# Altium project equalizer_project.PrjPcb
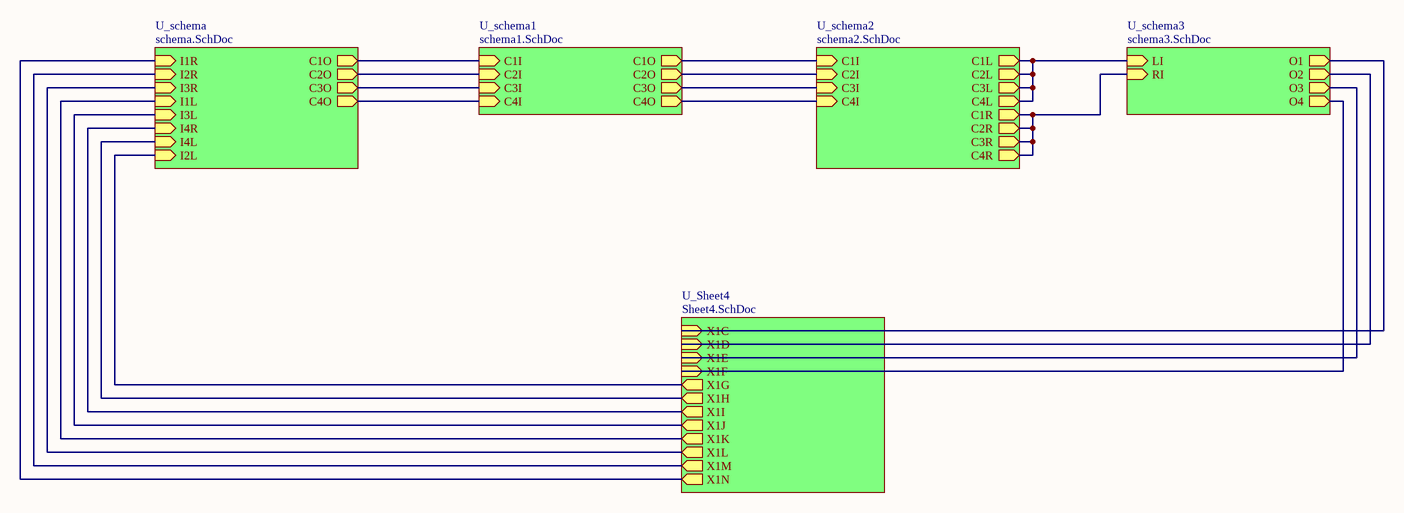
[diagram p0: top_sheet.SchDoc]
4 sheets, 127 parts. Net scope: hierarchical (ports join the sheet entries above them; power ports are global).
Board file: eq.PcbDoc
Sheets:
  top_sheet.SchDoc
    U_Sheet4 = Sheet4.SchDoc
    U_schema = schema.SchDoc
    U_schema3 = schema3.SchDoc

## Sheet top_sheet.SchDoc
size A4

### Sub-sheets
U_schema = schema.SchDoc: C1O (out), C2O (out), C3O (out), C4O (out), I1R (in), I2R (in), I3R (in), I1L (in), I3L (in), I4R (in), I4L (in), I2L (in)
U_schema1 = schema1.SchDoc (file not in this document): C1I (in), C2I (in), C3I (in), C4I (in), C1O (out), C2O (out), C4O (out), C3O (out)
U_schema2 = schema2.SchDoc (file not in this document): C1I (in), C2I (in), C3I (in), C4I (in), C1L (out), C1R (out), C2L (out), C2R (out), C3L (out), C3R (out), C4L (out), C4R (out)
U_schema3 = schema3.SchDoc: LI (in), RI (in), O1 (out), O2 (out), O3 (out), O4 (out)
U_Sheet4 = Sheet4.SchDoc: X1C (in), X1D (in), X1E (in), X1F (in), X1G (out), X1H (out), X1I (out), X1J (out), X1K (out), X1L (out), X1M (out), X1N (out)

### Nets
Net2514-_3: sheet U_Sheet4/X1C, sheet U_schema3/O1
Net2514-_4: sheet U_Sheet4/X1D, sheet U_schema3/O2
Net2514-_5: sheet U_Sheet4/X1E, sheet U_schema3/O3
Net2514-_6: sheet U_Sheet4/X1F, sheet U_schema3/O4
Net2514-_7: sheet U_Sheet4/X1G, sheet U_schema/I2L
Net2514-_8: sheet U_Sheet4/X1H, sheet U_schema/I4L
Net2514-_9: sheet U_Sheet4/X1I, sheet U_schema/I4R
Net2514-_10: sheet U_Sheet4/X1J, sheet U_schema/I3L
Net2514-_11: sheet U_Sheet4/X1K, sheet U_schema/I1L
Net2514-_12: sheet U_Sheet4/X1L, sheet U_schema/I3R
Net2514-_13: sheet U_Sheet4/X1M, sheet U_schema/I2R
Net2514-_14: sheet U_Sheet4/X1N, sheet U_schema/I1R
NetR53_2: sheet U_schema/C1O, sheet U_schema1/C1I
NetR54_2: sheet U_schema/C2O, sheet U_schema1/C2I
NetR55_2: sheet U_schema/C3O, sheet U_schema1/C3I
NetR56_2: sheet U_schema/C4O, sheet U_schema1/C4I
NetVR139_A3: sheet U_schema2/C1L, sheet U_schema2/C2L, sheet U_schema2/C3L, sheet U_schema2/C4L, sheet U_schema3/LI
NetVR139_B3: sheet U_schema2/C1R, sheet U_schema2/C2R, sheet U_schema2/C3R, sheet U_schema2/C4R, sheet U_schema3/RI
(unnamed): sheet U_schema1/C1O, sheet U_schema2/C1I
(unnamed): sheet U_schema1/C2O, sheet U_schema2/C2I
(unnamed): sheet U_schema1/C4O, sheet U_schema2/C4I
(unnamed): sheet U_schema1/C3O, sheet U_schema2/C3I

## Sheet Sheet4.SchDoc
size A4
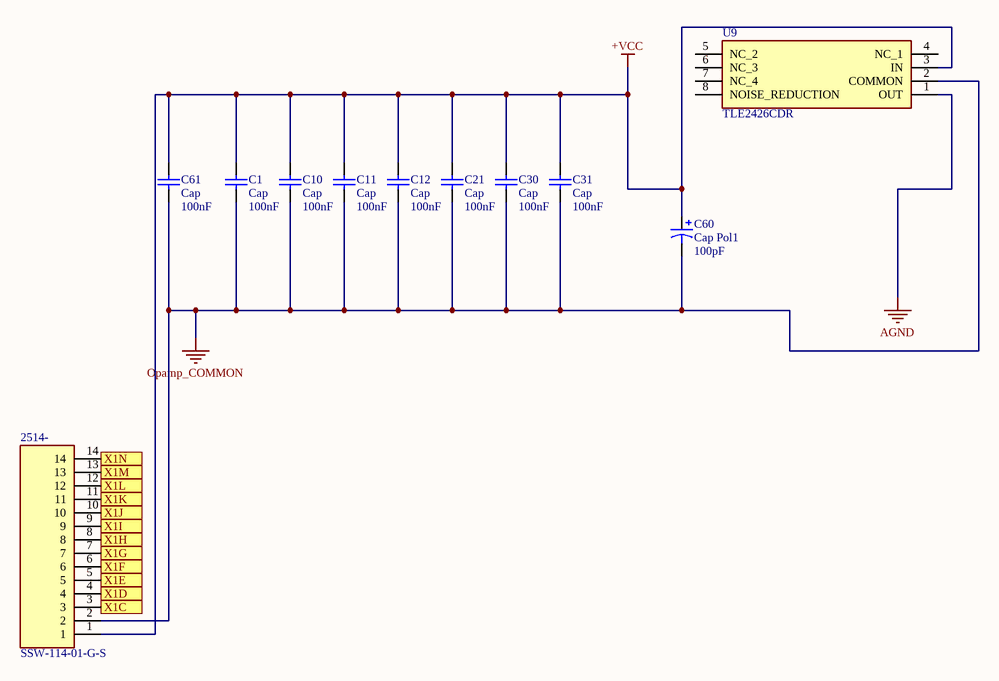
[diagram p1: Sheet4.SchDoc]

### Parts
2514-  SSW-114-01-G-S  [SHDR14W79P0X254_1X14_3607X241X851P]
C1  Cap  value 100nF  [SMD_CAPACITOR]
C10  Cap  value 100nF  [SMD_CAPACITOR]
C11  Cap  value 100nF  [SMD_CAPACITOR]
C12  Cap  value 100nF  [SMD_CAPACITOR]
C21  Cap  value 100nF  [SMD_CAPACITOR]
C30  Cap  value 100nF  [SMD_CAPACITOR]
C31  Cap  value 100nF  [SMD_CAPACITOR]
C60  Cap Pol1  value 100pF  [SMD_POLAR_CAPACITOR]
C61  Cap  value 100nF  [SMD_CAPACITOR]
U9  TLE2426CDR  [SOIC127P600X175-8N]

### Ports
X1C (in), X1D (in), X1E (in), X1F (in), X1G (out), X1H (out), X1I (out), X1J (out), X1K (out), X1L (out), X1M (out), X1N (out)

### Nets
+VCC: 2514-.1 C1.2 C10.2 C11.2 C12.2 C21.2 C30.2 C31.2 C60.1 C61.2 U9.3(IN)
AGND: U9.1(OUT)
Opamp_COMMON: 2514-.2 C1.1 C10.1 C11.1 C12.1 C21.1 C30.1 C31.1 C60.2 C61.1 U9.2(COMMON)  [project net opamp7gnd]
Net2514-_3: 2514-.3 ; port X1C
Net2514-_4: 2514-.4 ; port X1D
Net2514-_5: 2514-.5 ; port X1E
Net2514-_6: 2514-.6 ; port X1F
Net2514-_7: 2514-.7 ; port X1G
Net2514-_8: 2514-.8 ; port X1H
Net2514-_9: 2514-.9 ; port X1I
Net2514-_10: 2514-.10 ; port X1J
Net2514-_11: 2514-.11 ; port X1K
Net2514-_12: 2514-.12 ; port X1L
Net2514-_13: 2514-.13 ; port X1M
Net2514-_14: 2514-.14 ; port X1N

Not connected (* = marked no-connect by the designer): U9 4(NC_1) 5(NC_2) 6(NC_3) 7(NC_4) 8(NOISE_REDUCTION)

### Library data of the parts
2514- = SSW-114-01-G-S: Capacitor; Manufacturer_Name: SAMTEC; Datasheet Link: http://suddendocs.samtec.com/prints/ssw-1xx-xx-xxx-x-xx-xxx-xx-mkt.pdf; Height: 8.51mm; Manufacturer_Part_Number: SSW-114-01-G-S
C1 C10-C12 C21 C30 C31 C61 = Cap: Capacitor; Published: 8-Jun-2000; LatestRevisionDate: 17-Jul-2002; LatestRevisionNote: Re-released for DXP Platform.; PackageReference: RAD-0.3; Publisher: Altium Limited; PackageDescription: Radial Cap, Thru-Hole; 2 Leads; 0.3 in Pin Spacing
C60 = Cap Pol1: Polarized Capacitor (Radial); Published: 8-Jun-2000; LatestRevisionDate: 17-Jul-2002; LatestRevisionNote: Re-released for DXP Platform.; PackageReference: RB7.6-15; Publisher: Altium Limited; PackageDescription: Polarized Capacitor (Radial); 2 Leads
U9 = TLE2426CDR: Integrated Circuit; Manufacturer_Name: Texas Instruments; Datasheet Link: http://www.ti.com/lit/gpn/TLE2426; Height: 1.75mm; Mouser2 Part Number: 595-TLE2426CDR; Mouser2 Price/Stock: https://www.mouser.com/Search/Refine.aspx?Keyword=595-TLE2426CDR; Manufacturer_Part_Number: TLE2426CDR

## Sheet schema.SchDoc
size A3
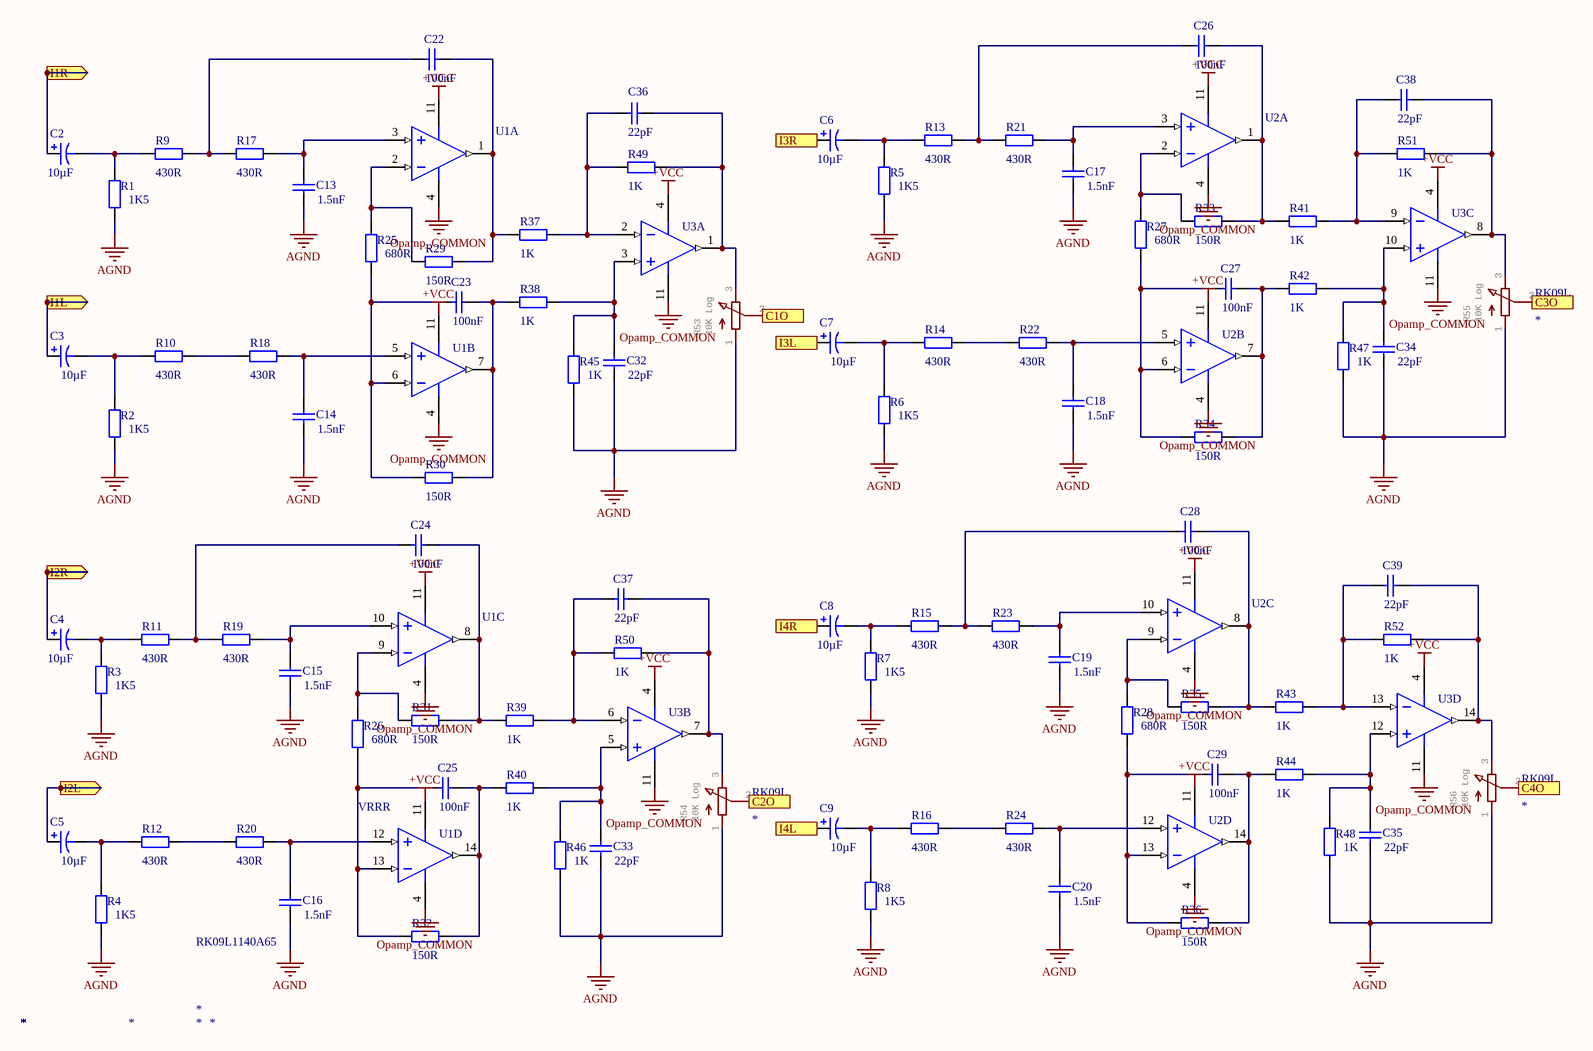
[diagram p2: schema.SchDoc]

### Parts
C2  value 10µF  [SMD_POLAR_CAPACITOR]  (hidden comment: Cap Pol1)
C3  value 10µF  [SMD_POLAR_CAPACITOR]  (hidden comment: Cap Pol1)
C4  value 10µF  [SMD_POLAR_CAPACITOR]  (hidden comment: Cap Pol1)
C5  value 10µF  [SMD_POLAR_CAPACITOR]  (hidden comment: Cap Pol1)
C6  value 10µF  [SMD_POLAR_CAPACITOR]  (hidden comment: Cap Pol1)
C7  value 10µF  [SMD_POLAR_CAPACITOR]  (hidden comment: Cap Pol1)
C8  value 10µF  [SMD_POLAR_CAPACITOR]  (hidden comment: Cap Pol1)
C9  value 10µF  [SMD_POLAR_CAPACITOR]  (hidden comment: Cap Pol1)
C13  value 1.5nF  [SMD_CAPACITOR]  (hidden comment: Cap)
C14  value 1.5nF  [SMD_CAPACITOR]  (hidden comment: Cap)
C15  value 1.5nF  [SMD_CAPACITOR]  (hidden comment: Cap)
C16  value 1.5nF  [SMD_CAPACITOR]  (hidden comment: Cap)
C17  value 1.5nF  [SMD_CAPACITOR]  (hidden comment: Cap)
C18  value 1.5nF  [SMD_CAPACITOR]  (hidden comment: Cap)
C19  value 1.5nF  [SMD_CAPACITOR]  (hidden comment: Cap)
C20  value 1.5nF  [SMD_CAPACITOR]  (hidden comment: Cap)
C22  value 100nF  [SMD_CAPACITOR]  (hidden comment: Cap)
C23  value 100nF  [SMD_CAPACITOR]  (hidden comment: Cap)
C24  value 100nF  [SMD_CAPACITOR]  (hidden comment: Cap)
C25  value 100nF  [SMD_CAPACITOR]  (hidden comment: Cap)
C26  value 100nF  [SMD_CAPACITOR]  (hidden comment: Cap)
C27  value 100nF  [SMD_CAPACITOR]  (hidden comment: Cap)
C28  value 100nF  [SMD_CAPACITOR]  (hidden comment: Cap)
C29  value 100nF  [SMD_CAPACITOR]  (hidden comment: Cap)
C32  value 22pF  [SMD_CAPACITOR]  (hidden comment: Cap)
C33  value 22pF  [SMD_CAPACITOR]  (hidden comment: Cap)
C34  value 22pF  [SMD_CAPACITOR]  (hidden comment: Cap)
C35  value 22pF  [SMD_CAPACITOR]  (hidden comment: Cap)
C36  value 22pF  [SMD_CAPACITOR]  (hidden comment: Cap)
C37  value 22pF  [SMD_CAPACITOR]  (hidden comment: Cap)
C38  value 22pF  [SMD_CAPACITOR]  (hidden comment: Cap)
C39  value 22pF  [SMD_CAPACITOR]  (hidden comment: Cap)
R1  value 1K5  [SMD_RESISTOR]  (hidden comment: Res2)
R2  value 1K5  [SMD_RESISTOR]  (hidden comment: Res2)
R3  value 1K5  [SMD_RESISTOR]  (hidden comment: Res2)
R4  value 1K5  [SMD_RESISTOR]  (hidden comment: Res2)
R5  value 1K5  [SMD_RESISTOR]  (hidden comment: Res2)
R6  value 1K5  [SMD_RESISTOR]  (hidden comment: Res2)
R7  value 1K5  [SMD_RESISTOR]  (hidden comment: Res2)
R8  value 1K5  [SMD_RESISTOR]  (hidden comment: Res2)
R9  value 430R  [SMD_RESISTOR]  (hidden comment: Res2)
R10  value 430R  [SMD_RESISTOR]  (hidden comment: Res2)
R11  value 430R  [SMD_RESISTOR]  (hidden comment: Res2)
R12  value 430R  [SMD_RESISTOR]  (hidden comment: Res2)
R13  value 430R  [SMD_RESISTOR]  (hidden comment: Res2)
R14  value 430R  [SMD_RESISTOR]  (hidden comment: Res2)
R15  value 430R  [SMD_RESISTOR]  (hidden comment: Res2)
R16  value 430R  [SMD_RESISTOR]  (hidden comment: Res2)
R17  value 430R  [SMD_RESISTOR]  (hidden comment: Res2)
R18  value 430R  [SMD_RESISTOR]  (hidden comment: Res2)
R19  value 430R  [SMD_RESISTOR]  (hidden comment: Res2)
R20  value 430R  [SMD_RESISTOR]  (hidden comment: Res2)
R21  value 430R  [SMD_RESISTOR]  (hidden comment: Res2)
R22  value 430R  [SMD_RESISTOR]  (hidden comment: Res2)
R23  value 430R  [SMD_RESISTOR]  (hidden comment: Res2)
R24  value 430R  [SMD_RESISTOR]  (hidden comment: Res2)
R25  value 680R  [SMD_RESISTOR]  (hidden comment: Res2)
R26  value 680R  [SMD_RESISTOR]  (hidden comment: Res2)
R27  value 680R  [SMD_RESISTOR]  (hidden comment: Res2)
R28  value 680R  [SMD_RESISTOR]  (hidden comment: Res2)
R29  value 150R  [SMD_RESISTOR]  (hidden comment: Res2)
R30  value 150R  [SMD_RESISTOR]  (hidden comment: Res2)
R31  value 150R  [SMD_RESISTOR]  (hidden comment: Res2)
R32  value 150R  [SMD_RESISTOR]  (hidden comment: Res2)
R33  value 150R  [SMD_RESISTOR]  (hidden comment: Res2)
R34  value 150R  [SMD_RESISTOR]  (hidden comment: Res2)
R35  value 150R  [SMD_RESISTOR]  (hidden comment: Res2)
R36  value 150R  [SMD_RESISTOR]  (hidden comment: Res2)
R37  value 1K  [SMD_RESISTOR]  (hidden comment: Res2)
R38  value 1K  [SMD_RESISTOR]  (hidden comment: Res2)
R39  value 1K  [SMD_RESISTOR]  (hidden comment: Res2)
R40  value 1K  [SMD_RESISTOR]  (hidden comment: Res2)
R41  value 1K  [SMD_RESISTOR]  (hidden comment: Res2)
R42  value 1K  [SMD_RESISTOR]  (hidden comment: Res2)
R43  value 1K  [SMD_RESISTOR]  (hidden comment: Res2)
R44  value 1K  [SMD_RESISTOR]  (hidden comment: Res2)
R45  value 1K  [SMD_RESISTOR]  (hidden comment: Res2)
R46  value 1K  [SMD_RESISTOR]  (hidden comment: Res2)
R47  value 1K  [SMD_RESISTOR]  (hidden comment: Res2)
R48  value 1K  [SMD_RESISTOR]  (hidden comment: Res2)
R49  value 1K  [SMD_RESISTOR]  (hidden comment: Res2)
R50  value 1K  [SMD_RESISTOR]  (hidden comment: Res2)
R51  value 1K  [SMD_RESISTOR]  (hidden comment: Res2)
R52  value 1K  [SMD_RESISTOR]  (hidden comment: Res2)
R53  value 10K Log  [RK09L1140A65]
R54  value 10K Log  [RK09L1140A65]
R55  value 10K Log  [RK09L1140A65]
R56  value 10K Log  [RK09L1140A65]
U1  OPA1664AIDR  [OPA1664AIDR]  (value not drawn)  (parts A,B,C,D of 4)
U2  OPA1664AIDR  [OPA1664AIDR]  (value not drawn)  (parts A,B,C,D of 4)
U3  OPA1664AIDR  [OPA1664AIDR]  (value not drawn)  (parts A,B,C,D of 4)
VRRR  RK09L1140A65  [RK09L1140A65]

### Ports
C1O (out), C2O (out), C3O (out), C4O (out), I1L (in), I1R (in), I2L (in), I2R (in), I3L (in), I3R (in), I4L (in), I4R (in)

### Nets
+VCC: U1.11(V-) U2.11(V-) U3.4(V+)
AGND: C13.1 C14.1 C15.1 C16.1 C17.1 C18.1 C19.1 C20.1 C32.1 C33.1 C34.1 C35.1 R1.1 R2.1 R3.1 R4.1 R5.1 R6.1 R7.1 R8.1 R45.1 R46.1 R47.1 R48.1 R53.1 R54.1 R55.1 R56.1
Opamp_COMMON: U1.4(V+) U2.4(V+) U3.11(V-)  [project net opamp7gnd]
Net2514-_7: C5.1 ; port I2L
Net2514-_8: C9.1 ; port I4L
Net2514-_9: C8.1 ; port I4R
Net2514-_10: C7.1 ; port I3L
Net2514-_11: C3.1 ; port I1L
Net2514-_12: C6.1 ; port I3R
Net2514-_13: C4.1 ; port I2R
Net2514-_14: C2.1 ; port I1R
NetC2_2: C2.2 R1.2 R9.1
NetC3_2: C3.2 R2.2 R10.1
NetC4_2: C4.2 R3.2 R11.1
NetC5_2: C5.2 R4.2 R12.1
NetC6_2: C6.2 R5.2 R13.1
NetC7_2: C7.2 R6.2 R14.1
NetC8_2: C8.2 R7.2 R15.1
NetC9_2: C9.2 R8.2 R16.1
NetC13_2: C13.2 R17.2 U1.3(IN_A+)
NetC14_2: C14.2 R18.2 U1.5(IN_B+)
NetC15_2: C15.2 R19.2 U1.10(IN_C+)
NetC16_2: C16.2 R20.2 U1.12(IN_D+)
NetC17_2: C17.2 R21.2 U2.3(IN_A+)
NetC18_2: C18.2 R22.2 U2.5(IN_B+)
NetC19_2: C19.2 R23.2 U2.10(IN_C+)
NetC20_2: C20.2 R24.2 U2.12(IN_D+)
NetC22_1: C22.1 R9.2 R17.1
NetC22_2: C22.2 R29.2 R37.1 U1.1(OUT_A)
NetC23_1: C23.1 R25.1 R30.1 U1.6(IN_B-)
NetC23_2: C23.2 R30.2 R38.1 U1.7(OUT_B)
NetC24_1: C24.1 R11.2 R19.1
NetC24_2: C24.2 R31.2 R39.1 U1.8(OUT_C)
NetC25_1: C25.1 R26.1 R32.1 U1.13(IN_D-)
NetC25_2: C25.2 R32.2 R40.1 U1.14(OUT_D)
NetC26_1: C26.1 R13.2 R21.1
NetC26_2: C26.2 R33.2 R41.1 U2.1(OUT_A)
NetC27_1: C27.1 R27.1 R34.1 U2.6(IN_B-)
NetC27_2: C27.2 R34.2 R42.1 U2.7(OUT_B)
NetC28_1: C28.1 R15.2 R23.1
NetC28_2: C28.2 R35.2 R43.1 U2.8(OUT_C)
NetC29_1: C29.1 R28.1 R36.1 U2.13(IN_D-)
NetC29_2: C29.2 R36.2 R44.1 U2.14(OUT_D)
NetC32_2: C32.2 R38.2 R45.2 U3.3(IN_A+)
NetC33_2: C33.2 R40.2 R46.2 U3.5(IN_B+)
NetC34_2: C34.2 R42.2 R47.2 U3.10(IN_C+)
NetC35_2: C35.2 R44.2 R48.2 U3.12(IN_D+)
NetC36_1: C36.1 R37.2 R49.1 U3.2(IN_A-)
NetC36_2: C36.2 R49.2 R53.3 U3.1(OUT_A)
NetC37_1: C37.1 R39.2 R50.1 U3.6(IN_B-)
NetC37_2: C37.2 R50.2 R54.3 U3.7(OUT_B)
NetC38_1: C38.1 R41.2 R51.1 U3.9(IN_C-)
NetC38_2: C38.2 R51.2 R55.3 U3.8(OUT_C)
NetC39_1: C39.1 R43.2 R52.1 U3.13(IN_D-)
NetC39_2: C39.2 R52.2 R56.3 U3.14(OUT_D)
NetR10_2: R10.2 R18.1
NetR12_2: R12.2 R20.1
NetR14_2: R14.2 R22.1
NetR16_2: R16.2 R24.1
NetR25_2: R25.2 R29.1 U1.2(IN_A-)
NetR26_2: R26.2 R31.1 U1.9(IN_C-)
NetR27_2: R27.2 R33.1 U2.2(IN_A-)
NetR28_2: R28.2 R35.1 U2.9(IN_C-)
NetR53_2: R53.2 ; port C1O
NetR54_2: R54.2 ; port C2O
NetR55_2: R55.2 ; port C3O
NetR56_2: R56.2 ; port C4O

### Library data of the parts
C2-C9 = Cap Pol1: Polarized Capacitor (Radial); Published: 8-Jun-2000; LatestRevisionDate: 17-Jul-2002; LatestRevisionNote: Re-released for DXP Platform.; PackageReference: RB7.6-15; Publisher: Altium Limited; PackageDescription: Polarized Capacitor (Radial); 2 Leads
C13-C20 C22-C29 C32-C39 = Cap: Capacitor; Published: 8-Jun-2000; LatestRevisionDate: 17-Jul-2002; LatestRevisionNote: Re-released for DXP Platform.; PackageReference: RAD-0.3; Publisher: Altium Limited; PackageDescription: Radial Cap, Thru-Hole; 2 Leads; 0.3 in Pin Spacing
R1-R52 = Res2: Resistor; Published: 8-Jun-2000; LatestRevisionDate: 17-Jul-2002; LatestRevisionNote: Re-released for DXP Platform.; PackageReference: AXIAL-0.4; Publisher: Altium Limited; PackageDescription: Axial Device, Thru-Hole; 2 Leads; 0.4 in Pin Spacing
R53-R56 = RK09L: GateName_1: G$1; SymbolName_1: POT_EU-; LibraryName: SD_Pots; DeviceSetName: RK09L
U1-U3 = CMP-0272-00211-3: Sound Plus Low-Power, Low-Noise and Distortion, Audio Operational Amplifier, 3 to 36 V, -40 to 85 degC, 14-pin SOIC (D14), Green (RoHS & no Sb/Br); Manufacturer: Texas Instruments; Iq per channel(Max)(mA): 1.5; IIB(Max)(pA): 1200000; Offset Drift(Typ)(uV/C): 2; Total Supply Voltage(Max)(+5V is 5, +/-5V is 10): 36; Rating: Catalog; Packing: LARGE T&R; Slew Rate(Typ)(V/us): 17; CMRR(Min)(dB): 106; Total Supply Voltage(Min)(+5V is 5, +/-5V is 10): 3; Sub Family: Audio Operational Amplifier, High Supply Voltage Amplifier (>=30V), Low Noise Amp (<=10nV/rtHz), Precision Amplifier; GBW(Typ)(MHz): 22; Number of Channels: 4; Code_JEDEC: MS-012; PartNumber: OPA1664AIDR; ComponentLink2Description: Datasheet; ComponentLink3URL: http://www.ti.com/lit/ml/mpds177g/mpds177g.pdf; PackageVersion: 4040047-5/M, 06/2011; ComponentLink1Description: Manufacturer URL; DatasheetVersion: SBOS489; Mounting Technology: Surface Mount; Vio (25C)(Max)(mV): 1.5; PackageReference: D0014A; ComponentLink1URL: http://www.ti.com/; ComponentLink2URL: http://www.ti.com/lit/ds/symlink/opa1664.pdf; Eco-Plan: Green (RoHS & no Sb/Br); PackageDescription: 14-Pin Plastic Small Outline, Body 8.65 x 3.9 mm, Pitch 1.27 mm; ComponentLink3Description: Package Specification
VRRR = RK09L1140A65: Variable Resistor; Manufacturer_Name: ALPS; Datasheet Link: https://componentsearchengine.com/Datasheets/1/RK09L1140A65.pdf; Height: 35mm; Mouser2 Part Number: 688-RK09L1140A65; Mouser2 Price/Stock: https://www.mouser.com/Search/Refine.aspx?Keyword=688-RK09L1140A65; Manufacturer_Part_Number: RK09L1140A65

## Sheet schema3.SchDoc
size A4
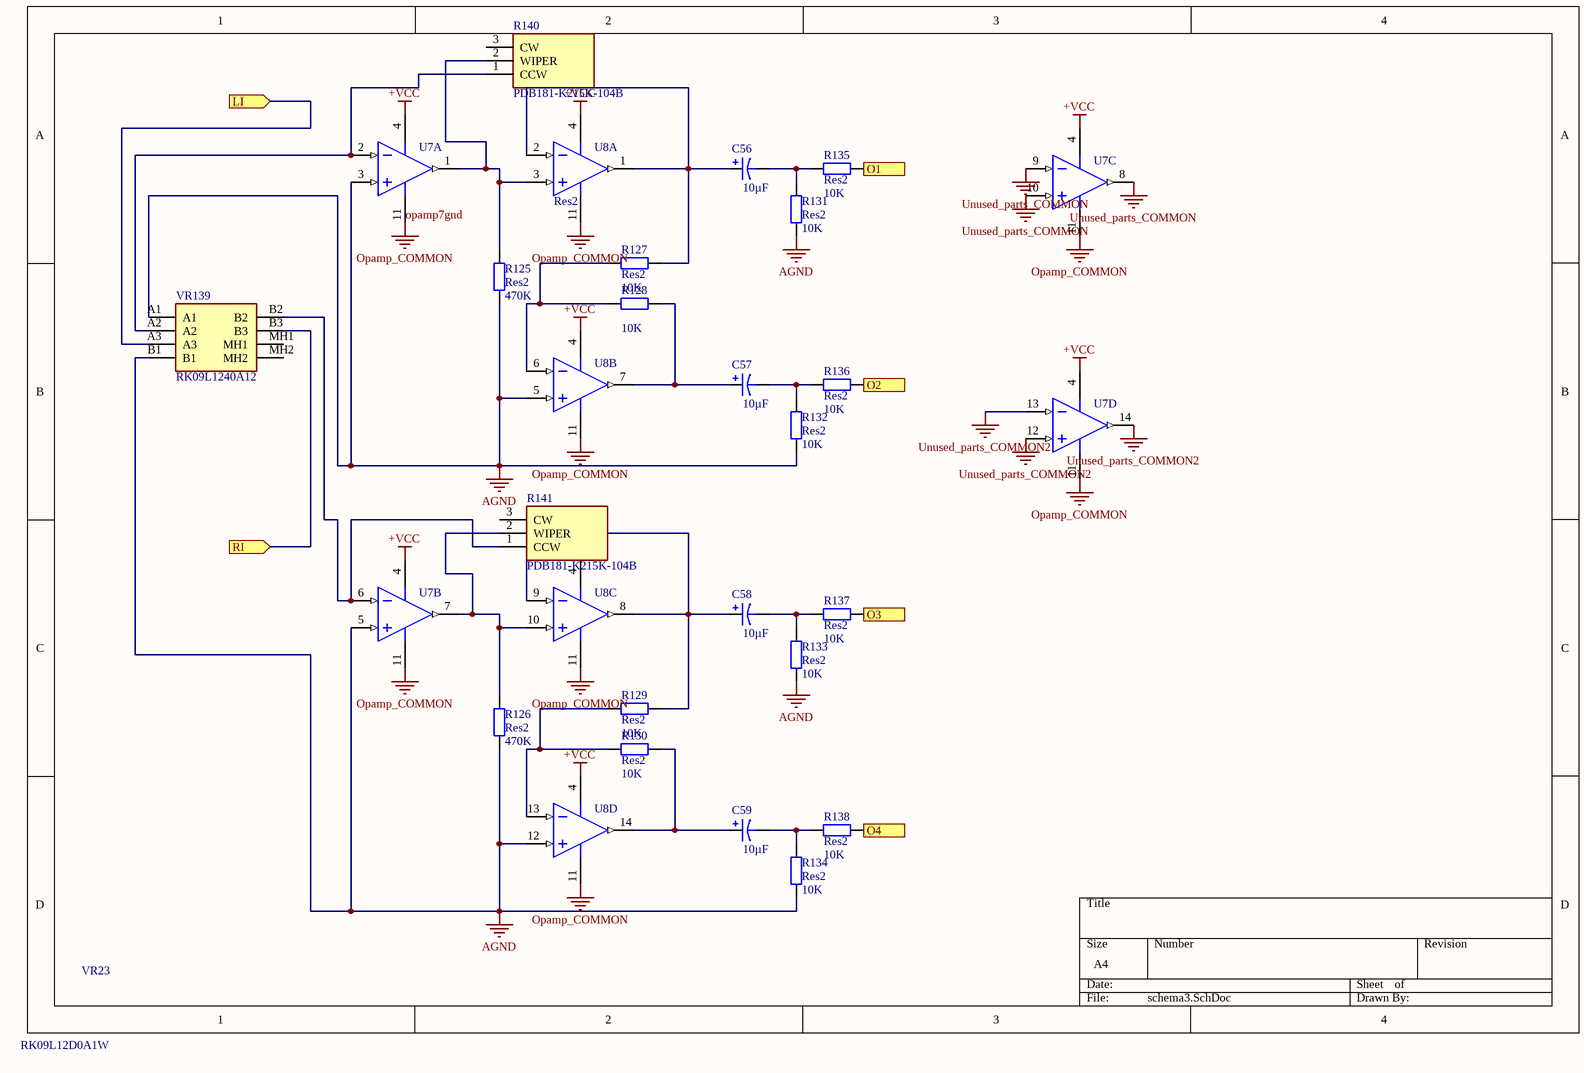
[diagram p3: schema3.SchDoc]

### Parts
C56  value 10µF  [SMD_POLAR_CAPACITOR]  (hidden comment: Cap Pol1)
C57  value 10µF  [SMD_POLAR_CAPACITOR]  (hidden comment: Cap Pol1)
C58  value 10µF  [SMD_POLAR_CAPACITOR]  (hidden comment: Cap Pol1)
C59  value 10µF  [SMD_POLAR_CAPACITOR]  (hidden comment: Cap Pol1)
R125  Res2  value 470K  [SMD_RESISTOR]
R126  Res2  value 470K  [SMD_RESISTOR]
R127  Res2  value 10K  [SMD_RESISTOR]
R128  Res2  value 10K  [SMD_RESISTOR]
R129  Res2  value 10K  [SMD_RESISTOR]
R130  Res2  value 10K  [SMD_RESISTOR]
R131  Res2  value 10K  [SMD_RESISTOR]
R132  Res2  value 10K  [SMD_RESISTOR]
R133  Res2  value 10K  [SMD_RESISTOR]
R134  Res2  value 10K  [SMD_RESISTOR]
R135  Res2  value 10K  [SMD_RESISTOR]
R136  Res2  value 10K  [SMD_RESISTOR]
R137  Res2  value 10K  [SMD_RESISTOR]
R138  Res2  value 10K  [SMD_RESISTOR]
R140  PDB181-K215K-104B  [PDB181K220K104B]
R141  PDB181-K215K-104B  [PDB181K220K104B]
U7  OPA1664AIDR  [OPA1664AIDR]  (value not drawn)  (parts A,B,C,D of 4)
U8  OPA1664AIDR  [OPA1664AIDR]  (value not drawn)  (parts A,B,C,D of 4)
VR23  RK09L12D0A1W  [RK09L12D0A1W]
VR139  RK09L1240A12  [RK09L124A12]

### Ports
LI (in), O1 (out), O2 (out), O3 (out), O4 (out), RI (in)

### Nets
+VCC: U7.4(V+) U8.4(V+)
AGND: R125.1 R126.1 R131.1 R132.1 R133.1 R134.1 U7.3(IN_A+) U7.5(IN_B+) U8.5(IN_B+) U8.12(IN_D+) VR139.A1 VR139.B1
opamp7gnd: U7.11(V-) U8.11(V-)  [also labelled Opamp_COMMON]
Unused_parts_COMMON: U7.8(OUT_C) U7.9(IN_C-) U7.10(IN_C+)
Unused_parts_COMMON2: U7.12(IN_D+) U7.13(IN_D-) U7.14(OUT_D)
Net2514-_3: R135.2 ; port O1
Net2514-_4: R136.2 ; port O2
Net2514-_5: R137.2 ; port O3
Net2514-_6: R138.2 ; port O4
NetC56_1: C56.1 R127.2 U8.1(OUT_A) U8.2(IN_A-)
NetC56_2: C56.2 R131.2 R135.1
NetC57_1: C57.1 R128.2 U8.7(OUT_B)
NetC57_2: C57.2 R132.2 R136.1
NetC58_1: C58.1 R129.2 U8.8(OUT_C) U8.9(IN_C-)
NetC58_2: C58.2 R133.2 R137.1
NetC59_1: C59.1 R130.2 U8.14(OUT_D)
NetC59_2: C59.2 R134.2 R138.1
NetR125_2: R125.2 R140.2(WIPER) U7.1(OUT_A) U8.3(IN_A+)
NetR126_2: R126.2 R141.2(WIPER) U7.7(OUT_B) U8.10(IN_C+)
NetR127_1: R127.1 R128.1 U8.6(IN_B-)
NetR129_1: R129.1 R130.1 U8.13(IN_D-)
NetR140_1: R140.1(CCW) U7.2(IN_A-) VR139.A2
NetR141_1: R141.1(CCW) U7.6(IN_B-) VR139.B2
NetVR139_A3: VR139.A3 ; port LI
NetVR139_B3: VR139.B3 ; port RI

Not connected (* = marked no-connect by the designer): R140 3(CW); R141 3(CW); VR139 MH1 MH2

### Library data of the parts
C56-C59 = Cap Pol1: Polarized Capacitor (Radial); Published: 8-Jun-2000; LatestRevisionDate: 17-Jul-2002; LatestRevisionNote: Re-released for DXP Platform.; PackageReference: RB7.6-15; Publisher: Altium Limited; PackageDescription: Polarized Capacitor (Radial); 2 Leads
R125-R138 = Res2: Resistor; Published: 8-Jun-2000; LatestRevisionDate: 17-Jul-2002; LatestRevisionNote: Re-released for DXP Platform.; PackageReference: AXIAL-0.4; Publisher: Altium Limited; PackageDescription: Axial Device, Thru-Hole; 2 Leads; 0.4 in Pin Spacing
R140 R141 = PDB181-K215K-104B: Variable Resistor; Manufacturer_Name: Bourns; Height: 16.5mm; Manufacturer_Part_Number: PDB181-K215K-104B
U7 U8 = CMP-0272-00211-3: as U1 on sheet schema; Code_JEDEC: MS-012; PartNumber: OPA1664AIDR; ComponentLink2Description: Datasheet; ComponentLink3URL: http://www.ti.com/lit/ml/mpds177g/mpds177g.pdf; PackageVersion: 4040047-5/M, 06/2011; ComponentLink1Description: Manufacturer URL; DatasheetVersion: SBOS489; Mounting Technology: Surface Mount; Vio (25C)(Max)(mV): 1.5; PackageReference: D0014A; ComponentLink1URL: http://www.ti.com/; ComponentLink2URL: http://www.ti.com/lit/ds/symlink/opa1664.pdf; Eco-Plan: Green (RoHS & no Sb/Br); PackageDescription: 14-Pin Plastic Small Outline, Body 8.65 x 3.9 mm, Pitch 1.27 mm; ComponentLink3Description: Package Specification
VR23 = RK09L12D0A1W: Variable Resistor; Manufacturer_Name: ALPS; Datasheet Link: https://componentsearchengine.com/Datasheets/1/RK09L12D0A1W.pdf; Height: 25mm; Mouser2 Part Number: 688-RK09L12D0A1W; Mouser2 Price/Stock: https://www.mouser.com/Search/Refine.aspx?Keyword=688-RK09L12D0A1W; Manufacturer_Part_Number: RK09L12D0A1W
VR139 = RK09L1240A12: Variable Resistor; Manufacturer_Name: ALPS; Datasheet Link: https://componentsearchengine.com/Datasheets/1/RK09L1240A12.pdf; Height: 30mm; Mouser2 Part Number: 688-RK09L1240A12; Mouser2 Price/Stock: https://www.mouser.com/Search/Refine.aspx?Keyword=688-RK09L1240A12; Manufacturer_Part_Number: RK09L1240A12

## Nets that join several sheets
+VCC: Sheet4 (11 pins), schema (U1.11 U2.11 U3.4), schema3 (U7.4 U8.4)
AGND: Sheet4 (U9.1), schema (28 pins), schema3 (12 pins)
opamp7gnd: Sheet4 (11 pins), schema (U1.4 U2.4 U3.11), schema3 (U7.11 U8.11)
Net2514-_3: Sheet4 (2514-.3), schema3 (R135.2)
Net2514-_4: Sheet4 (2514-.4), schema3 (R136.2)
Net2514-_5: Sheet4 (2514-.5), schema3 (R137.2)
Net2514-_6: Sheet4 (2514-.6), schema3 (R138.2)
Net2514-_7: Sheet4 (2514-.7), schema (C5.1)
Net2514-_8: Sheet4 (2514-.8), schema (C9.1)
Net2514-_9: Sheet4 (2514-.9), schema (C8.1)
Net2514-_10: Sheet4 (2514-.10), schema (C7.1)
Net2514-_11: Sheet4 (2514-.11), schema (C3.1)
Net2514-_12: Sheet4 (2514-.12), schema (C6.1)
Net2514-_13: Sheet4 (2514-.13), schema (C4.1)
Net2514-_14: Sheet4 (2514-.14), schema (C2.1)